# Altium schematic sheet Power.SchDoc
size 127 x 177 mm; SheetNumber: 1; SheetTotal: 5
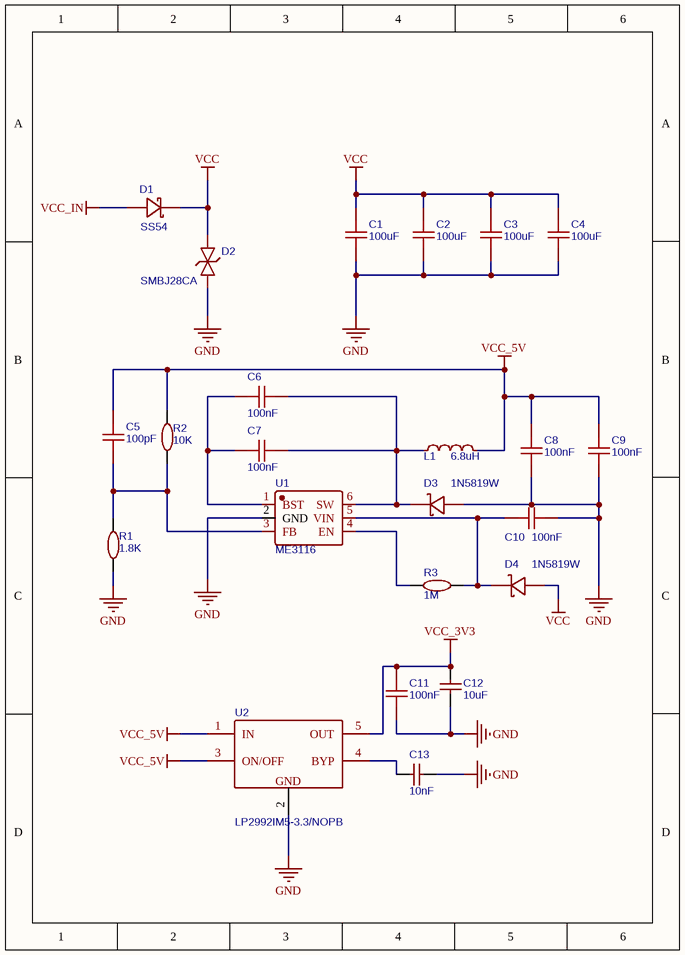
[diagram p0: Power.SchDoc]

## Parts
C1  100uF  [C1206]
C2  100uF  [C1206]
C3  100uF  [C1206]
C4  100uF  [C1206]
C5  100pF  [C0603]
C6  100nF  [C0603]
C7  100nF  [C0603]
C8  100nF  [C0603]
C9  100nF  [C0603]
C10  100nF  [C0603]
C11  100nF  [C0603]
C12  10uF  [C1206]
C13  10nF  [C0603]
D1  SS54  [SMA_L4.3-W2.6-LS5.0-RD]
D2  SMBJ28CA  [SMB_L4.6-W3.6-LS5.3-BI]
D3  1N5819W  [SOD-123F_L2.8-W1.8-LS3.7-RD]
D4  1N5819W  [SOD-123F_L2.8-W1.8-LS3.7-RD]
L1  6.8uH  [IND-SMD_L7.0-W6.6]
R1  1.8K  [R0603]
R2  10K  [R0603]
R3  1M  [R0603]
U1  ME3116  [SOT-23-6_L2.9-W1.6-P0.95-LS2.8-BL]
U2  LP2992IM5-3.3/NOPB  [SOT-23-5_L3.0-W1.7-P0.95-LS2.8-BR]

## Nets
GND: C1.2 C2.2 C3.2 C4.2 C8.1 C9.1 C10.1 C11.1 C12.1 C13.2 D2.1 D3.2 R1.1 U1.2(GND) U2.2(GND)
VCC: C1.1 C2.1 C3.1 C4.1 D1.1 D2.2 D4.2
VCC_3V3: C11.2 C12.2 U2.5(OUT)
VCC_5V: C5.2 C8.2 C9.2 L1.2 R2.2 U2.1(IN) U2.3(ON/OFF)
VCC_IN: D1.2
NetC5_1: C5.1 R1.2 R2.1 U1.3(FB)
NetC6_1: C6.1 C7.1 U1.1(BST)
NetC6_2: C6.2 C7.2 D3.1 L1.1 U1.6(SW)
NetC10_2: C10.2 D4.1 R3.2 U1.5(VIN)
NetC13_1: C13.1 U2.4(BYP)
NetR3_1: R3.1 U1.4(EN)

## Library data of the parts
C1-C4 = 100uF: BOM_Manufacturer: Murata Electronics; BOM_Manufacturer Part: GRM31CR61A107ME05L; nameAlias: Capacitance; Contributor: LCSC; BOM_Supplier: LCSC; BOM_Supplier Part: C312983; BOM_JLCPCB Part Class: Extended Part; spicePre: C; spiceSymbolName: GRM31CR61A107ME05L
C5 = 100pF: BOM_Manufacturer: YAGEO; BOM_Manufacturer Part: CC0603JRNPO9BN101; nameAlias: Capacitance; BOM_Supplier: LCSC; BOM_Supplier Part: C14665; BOM_JLCPCB Part Class: Extended Part; spicePre: C; spiceSymbolName: CC0603JRNPO9BN101
C6-C11 = 100nF: BOM_Manufacturer: SAMSUNG; BOM_Manufacturer Part: CL10B104KB8NNNC; nameAlias: Capacitance; BOM_Supplier: LCSC; BOM_Supplier Part: C1591; BOM_JLCPCB Part Class: Extended Part; spicePre: C; spiceSymbolName: CL10B104KB8NNNC
C12 = 10uF: BOM_Manufacturer Part: CL31A106KBHNNNE; BOM_Manufacturer: SAMSUNG; nameAlias: Capacitance; BOM_Supplier: LCSC; BOM_Supplier Part: C13585; BOM_JLCPCB Part Class: Basic Part; spicePre: C; spiceSymbolName: CL31A106KBHNNNE
C13 = 10nF: BOM_Manufacturer: YAGEO; BOM_Manufacturer Part: CC0603KRX7R9BB103; nameAlias: Capacitance; BOM_Supplier: LCSC; BOM_Supplier Part: C100042; BOM_JLCPCB Part Class: Extended Part; spicePre: C; spiceSymbolName: CC0603KRX7R9BB103
D1 = SS54_C727065: BOM_Manufacturer: TWGMC; Contributor: LCSC; BOM_Supplier: LCSC; BOM_Supplier Part: C727065; BOM_Manufacturer Part: SS54; BOM_JLCPCB Part Class: Extended Part; spicePre: D; spiceSymbolName: SS54_C727065
D2 = SMBJ28CA_C908204: BOM_Manufacturer: FUXINSEMI; Contributor: LCSC; BOM_Supplier: LCSC; BOM_Supplier Part: C908204; BOM_Manufacturer Part: SMBJ28CA; BOM_JLCPCB Part Class: Extended Part; spicePre: D; spiceSymbolName: SMBJ28CA_C908204
D3 D4 = 1N5819W: BOM_Manufacturer: Shandong Jingdao Microelectronics; Contributor: LCSC; BOM_Supplier: LCSC; BOM_Supplier Part: C169540; BOM_Manufacturer Part: 1N5819W; BOM_JLCPCB Part Class: Extended Part; spicePre: D; spiceSymbolName: 1N5819W
L1 = 6.8uH: BOM_Manufacturer: Sunlord; BOM_Manufacturer Part: MWSA0603S-6R8MT; nameAlias: Inductance; Contributor: LCSC; BOM_Supplier: LCSC; BOM_Supplier Part: C408449; BOM_JLCPCB Part Class: Extended Part; spicePre: L; spiceSymbolName: MWSA0603S-6R8MT
R1 = 1.8K: BOM_Manufacturer: UniOhm; BOM_Manufacturer Part: 0603WAF1801T5E; nameAlias: Resistance (Ohms); BOM_Supplier: LCSC; BOM_Supplier Part: C4177; BOM_JLCPCB Part Class: Basic Part; spicePre: R; spiceSymbolName: 0603WAF1801T5E
R2 = 10K: BOM_Manufacturer: UniOhm; BOM_Manufacturer Part: 0603WAF1002T5E; nameAlias: Resistance (Ohms); BOM_Supplier: LCSC; BOM_Supplier Part: C25804; BOM_JLCPCB Part Class: Basic Part; spicePre: R; spiceSymbolName: 0603WAF1002T5E
R3 = 1M: BOM_Manufacturer: UniOhm; BOM_Manufacturer Part: 0603WAF1004T5E; nameAlias: Resistance (Ohms); BOM_Supplier: LCSC; BOM_Supplier Part: C22935; BOM_JLCPCB Part Class: Basic Part; spicePre: R; spiceSymbolName: 0603WAF1004T5E
U1 = TP6841S6-A: BOM_Manufacturer: TECH PUBLIC(台舟); Contributor: LCSC; BOM_Supplier: LCSC; BOM_Supplier Part: C2844924; BOM_Manufacturer Part: TP6841S6-A; BOM_JLCPCB Part Class: Extended Part; spicePre: U; spiceSymbolName: TP6841S6-A
U2 = LP2992IM5-3.3/NOPB: BOM_Manufacturer: TI; Contributor: LCSC; BOM_Supplier: LCSC; BOM_Manufacturer Part: LP2992IM5-3.3/NOPB; BOM_Supplier Part: C129353; BOM_JLCPCB Part Class: Extended Part; spicePre: U; spiceSymbolName: LP2992IM5-3.3/NOPB